# Altium schematic sheet Alternate power.SchDoc
size A4; SheetNumber: 4; SheetTotal: 8
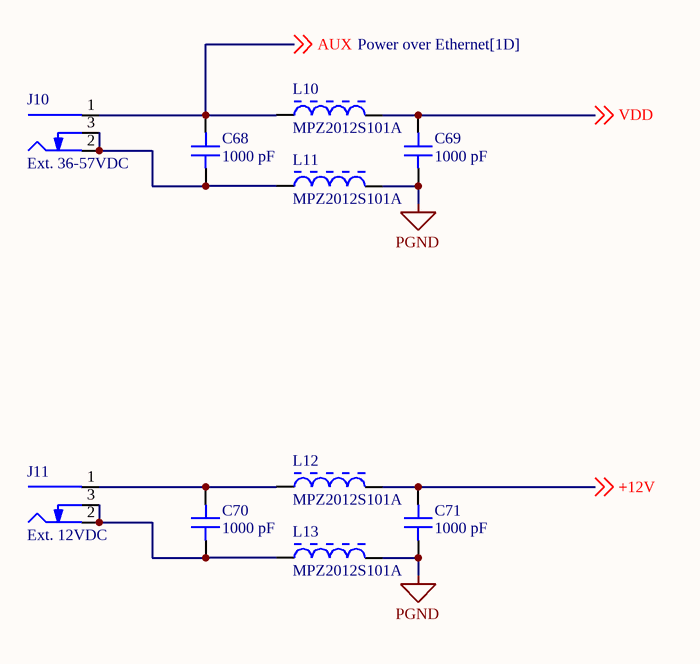
[diagram p0: Alternate power.SchDoc]

## Parts
C68  1000 pF  [CAP 0603_1608]
C69  1000 pF  [CAP 0603_1608]
C70  1000 pF  [CAP 0603_1608]
C71  1000 pF  [CAP 0603_1608]
J10  Ext. 36-57VDC  [CUI PJ-002AH-SMT-TR]
J11  Ext. 12VDC  [CUI PJ-002AH-SMT-TR]
L10  MPZ2012S101A  [TDK-MPZ2012S101A-2_V]
L11  MPZ2012S101A  [TDK-MPZ2012S101A-2_V]
L12  MPZ2012S101A  [TDK-MPZ2012S101A-2_V]
L13  MPZ2012S101A  [TDK-MPZ2012S101A-2_V]

## Nets
PGND: C69.1 C71.1 L11.2 L13.2
+12V: C71.2 L12.2 ; off-sheet +12V
AUX: C68.2 J10.1(Centre) L10.1 ; off-sheet AUX
VDD: C69.2 L10.2 ; off-sheet VDD
NetC68_1: C68.1 J10.2(Outer) J10.3(SW) L11.1
NetC70_1: C70.1 J11.2(Outer) J11.3(SW) L13.1
NetC70_2: C70.2 J11.1(Centre) L12.1

## Library data of the parts
C68-C71 = C1608X7R2A102K080AA: CAP CER 1000PF 100V X7R 0603; manufacturer: TDK Corporation; Tolerance: ±10%; Part Number: C1608X7R2A102K080AA; Capacitance: 1000 pF; Applications: General Purpose; componentlink1description: Datasheet; componentlink1url: https://product.tdk.com/info/en/catalog/datasheets/mlcc_commercial_midvoltage_en.pdf?ref_disty=digikey; componentlink2description: DigiKey Link; componentlink2url: https://www.digikey.com/en/products/detail/tdk-corporation/C1608X7R2A102K080AA/513825; Device Package: 0603 (1608 Metric); lastupdated: 9.02.2024 20:10:29; Lifecycle Status: Active; Minimum Order: 1; Mounting Type: Surface Mount, MLCC; Operating Temperature: -55°C ~ 125°C; Package / Case: 0603 (1608 Metric); packaging: TapeAndReel; partid: 3499; Part Status: Active; price: 0.01; series: C; Size / Dimension: 0.063" L x 0.031" W (1.60mm x 0.80mm); Supplier 1: DigiKey; Supplier Part Number 1: 445-1298-1-ND; Temperature Coefficient: X7R; Thickness (Max): 0.035" (0.90mm); value: 1000 pF; Voltage - Rated: 100V
J10 J11 = PJ-002AH-SMT-TR: CONN PWR JACK 2X5.5MM SOLDER; Manufacturer: CUI Devices; Actual Diameter: 0.079" (2.00mm ID), 0.256" (6.50mm OD); Current Rating (Amps): 5A; Gender: Male; Industry Recognized Mating Diameter: 2.00mm ID (0.079"), 5.50mm OD (0.217"); Internal Switch(s): Single Switch, Normally Closed; Material Flammability Rating: UL94 V-0; Mating Length/Depth: 0.350" (8.90mm); Number of Positions/Contacts: 2 Conductors, 3 Contacts; Shielding: Unshielded; Voltage - Rated: 24VDC; Part Number: PJ-002AH-SMT-TR; ComponentLink1Description: Datasheet; ComponentLink1URL: https://www.cuidevices.com/product/resource/digikeypdf/pj-002ah-smt-tr.pdf; ComponentLink2Description: DigiKey Link; ComponentLink2URL: http://digikey.com/product-detail/en/cui-devices/PJ-002AH-SMT-TR/CP-002AHPJCT-ND/669692; Connector Type: Jack; Features: Board Guide; LastUpdated: 26.05.2020 13:33:39; Lifecycle Status: Active; Minimum Order: 1; Mounting Type: Surface Mount; Packaging: TapeAndReel; Part Status: Active; Price: 0.90; Series: -; Supplier 1: DigiKey; Supplier Part Number 1: CP-002AHPJCT-ND; Termination: Solder
L10-L13 = CMP-2000-05399-1: Chip Bead for Power Line, 100 Ohm, +/- 25%, 4 A, -55 to 125 degC, 0805 (2012 Metric), RoHS, Tape and Reel; Manufacturer: TDK; Maximum DC Resistance: 20mOhms; Test Frequency: 100MHz; Impedance: 100Ohms; Case Width: 1.25mm; Case Length: 2mm; Maximum DC Current: 4A; Case Height: 0.85mm; Package Reference: MPZ2012S101A-2; RoHS: Details; Tolerance: 25%; Operating Temperature Range: -55Cto+125C; Datasheet Version: Jul-13; Dimensions: 1.25mmWx2mmLx0.85mmH; Product: FerriteChipBeads; Termination Style: SMD/SMT; Datasheet URL: http://www.farnell.com/datasheets/1750041.pdf; Factory Pack Quantity: 4000; Brand: TDK; Packaging: Reel; Package Description: 2-Pin Surface Mount Device, Body 2 x 1.25 mm; Product Category: EMIFilterBeads,Chips&Arrays; Manufacturer URL: http://www.tdk.com/; Package / Case: 0805(2012metric)